# EAGLE design pcbWithoutuE (EAGLE 9.1.3)
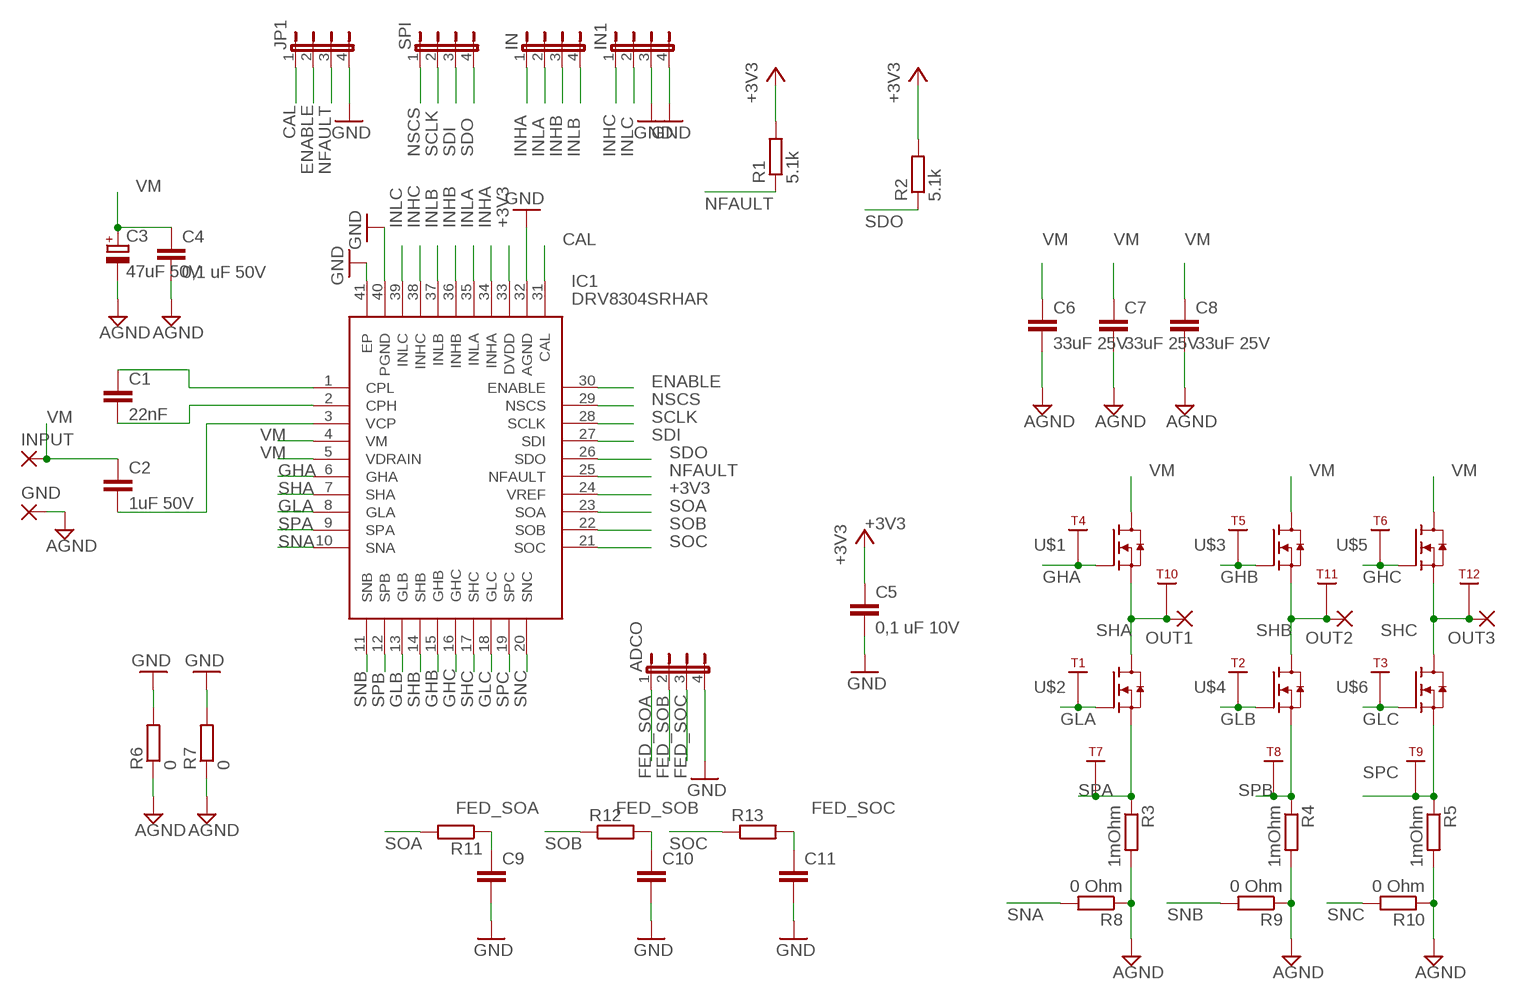
[diagram p0: schematic, sheet 1]

## Parts
ADCO  JP4E  [JP4]
C1  22nF  C-EUC0805K  [C0805K]
C2  1uF 50V  C-EUC0805K  [C0805K]
C3  47uF 50V  CPOL-EUE7.5-16  [E7,5-16]
C4  0,1 uF 50V  C-EUC0805K  [C0805K]
C5  0,1 uF 10V  C-EUC0805K  [C0805K]
C6  33uF 25V  C-EUC1206K  [C1206K]
C7  33uF 25V  C-EUC1206K  [C1206K]
C8  33uF 25V  C-EUC1206K  [C1206K]
C9  C-EUC0805  [C0805]
C10  C-EUC0805  [C0805]
C11  C-EUC0805  [C0805]
GND  3,17/1,3  [3,17/1,3]
IC1  DRV8304SRHAR  [QFN50P600X600X100-41N]
IN  JP4E  [JP4]
IN1  JP4E  [JP4]
INPUT  3,17/1,3  [3,17/1,3]
JP1  JP4E  [JP4]
OUT1  SMD2  [SMD1,27-2,54]
OUT2  SMD2  [SMD1,27-2,54]
OUT3  SMD2  [SMD1,27-2,54]
R1  5.1k  R-EU_R0805  [R0805]
R2  5.1k  R-EU_R0805  [R0805]
R3  1mOhm  R-EU_R1216_SHUNT  [1216]
R4  1mOhm  R-EU_R1216_SHUNT  [1216]
R5  1mOhm  R-EU_R1216_SHUNT  [1216]
R6  0  R-EU_R0805W  [R0805W]
R7  0  R-EU_R0805W  [R0805W]
R8  0 Ohm  R-EU_R0603  [R0603]
R9  0 Ohm  R-EU_R0603  [R0603]
R10  0 Ohm  R-EU_R0603  [R0603]
R11  R-EU_R0805  [R0805]
R12  R-EU_R0805  [R0805]
R13  R-EU_R0805  [R0805]
SPI  JP4E  [JP4]
T1  TEST_POINT1593  [TURRET_TERMINAL_1593]
T2  TEST_POINT1593  [TURRET_TERMINAL_1593]
T3  TEST_POINT1593  [TURRET_TERMINAL_1593]
T4  TEST_POINT1593  [TURRET_TERMINAL_1593]
T5  TEST_POINT1593  [TURRET_TERMINAL_1593]
T6  TEST_POINT1593  [TURRET_TERMINAL_1593]
T7  TEST_POINT1593  [TURRET_TERMINAL_1593]
T8  TEST_POINT1593  [TURRET_TERMINAL_1593]
T9  TEST_POINT1593  [TURRET_TERMINAL_1593]
T10  TEST_POINT1593  [TURRET_TERMINAL_1593]
T11  TEST_POINT1593  [TURRET_TERMINAL_1593]
T12  TEST_POINT1593  [TURRET_TERMINAL_1593]
U$1  SIRA80DP-T1-RE3-CLASSIC  [SI7852ADPT1GE3]
U$2  SIRA80DP-T1-RE3-CLASSIC  [SI7852ADPT1GE3]
U$3  SIRA80DP-T1-RE3-CLASSIC  [SI7852ADPT1GE3]
U$4  SIRA80DP-T1-RE3-CLASSIC  [SI7852ADPT1GE3]
U$5  SIRA80DP-T1-RE3-CLASSIC  [SI7852ADPT1GE3]
U$6  SIRA80DP-T1-RE3-CLASSIC  [SI7852ADPT1GE3]

## Nets
+3V3: C5.1 IC1.24(VREF) IC1.33(DVDD) R1.2 R2.2
AGND: C3.- C4.2 C6.2 C7.2 C8.2 GND.1(P) R3.P$2 R3.P$4 R4.P$2 R4.P$4 R5.P$2 R5.P$4 R6.1 R7.1 R8.1 R9.1 R10.1
CAL: IC1.31(CAL) JP1.1
ENABLE: IC1.30(ENABLE) JP1.2
FED_SOA: ADCO.1 C9.1 R11.1
FED_SOB: ADCO.2 C10.1 R12.2
FED_SOC: ADCO.3 C11.1 R13.2
GHA: IC1.6(GHA) T4.1 U$1.4(G)
GHB: IC1.15(GHB) T5.1 U$3.4(G)
GHC: IC1.16(GHC) T6.1 U$5.4(G)
GLA: IC1.8(GLA) T1.1 U$2.4(G)
GLB: IC1.13(GLB) T2.1 U$4.4(G)
GLC: IC1.18(GLC) T3.1 U$6.4(G)
GND: ADCO.4 C5.2 C9.2 C10.2 C11.2 IC1.32(AGND) IC1.40(PGND) IC1.41(EP) IN1.3 IN1.4 JP1.4 R6.2 R7.2
INHA: IC1.34(INHA) IN.1
INHB: IC1.36(INHB) IN.3
INHC: IC1.38(INHC) IN1.1
INLA: IC1.35(INLA) IN.2
INLB: IC1.37(INLB) IN.4
INLC: IC1.39(INLC) IN1.2
N$1: C1.1 IC1.1(CPL)
N$2: C1.2 IC1.2(CPH)
N$3: C2.2 IC1.3(VCP)
NFAULT: IC1.25(NFAULT) JP1.3 R1.1
NSCS: IC1.29(NSCS) SPI.1
SCLK: IC1.28(SCLK) SPI.2
SDI: IC1.27(SDI) SPI.3
SDO: IC1.26(SDO) R2.1 SPI.4
SHA: IC1.7(SHA) OUT1.1(P) T10.1 U$1.1(S) U$1.2(S) U$1.3(S) U$2.5(D) U$2.6(D) U$2.7(D) U$2.8(D) U$2.9(D) U$2.10(D) U$2.11(D)
SHB: IC1.14(SHB) OUT2.1(P) T11.1 U$3.1(S) U$3.2(S) U$3.3(S) U$4.5(D) U$4.6(D) U$4.7(D) U$4.8(D) U$4.9(D) U$4.10(D) U$4.11(D)
SHC: IC1.17(SHC) OUT3.1(P) T12.1 U$5.1(S) U$5.2(S) U$5.3(S) U$6.5(D) U$6.6(D) U$6.7(D) U$6.8(D) U$6.9(D) U$6.10(D) U$6.11(D)
SNA: IC1.10(SNA) R8.2
SNB: IC1.11(SNB) R9.2
SNC: IC1.20(SNC) R10.2
SOA: IC1.23(SOA) R11.2
SOB: IC1.22(SOB) R12.1
SOC: IC1.21(SOC) R13.1
SPA: IC1.9(SPA) R3.P$1 R3.P$3 T7.1 U$2.1(S) U$2.2(S) U$2.3(S)
SPB: IC1.12(SPB) R4.P$1 R4.P$3 T8.1 U$4.1(S) U$4.2(S) U$4.3(S)
SPC: IC1.19(SPC) R5.P$1 R5.P$3 T9.1 U$6.1(S) U$6.2(S) U$6.3(S)
VM: C2.1 C3.+ C4.1 C6.1 C7.1 C8.1 IC1.4(VM) IC1.5(VDRAIN) INPUT.1(P) U$1.5(D) U$1.6(D) U$1.7(D) U$1.8(D) U$1.9(D) U$1.10(D) U$1.11(D) U$3.5(D) U$3.6(D) U$3.7(D) U$3.8(D) U$3.9(D) U$3.10(D) U$3.11(D) U$5.5(D) U$5.6(D) U$5.7(D) U$5.8(D) U$5.9(D) U$5.10(D) U$5.11(D)

## Library data of the parts
ADCO IN IN1 JP1 SPI = jumper:JP4E: JUMPER
C1 C2 C4-C8 = rcl:C-EU: CAPACITOR, European symbol; SPICEPREFIX: C
C3 = rcl:CPOL-EU: POLARIZED CAPACITOR, European symbol; SPICEPREFIX: C
C9-C11 = resistor:C-EU: CAPACITOR, European symbol
GND INPUT = wirepad:3,17/1,3: THROUGH-HOLE PAD
IC1 = SamacSys_Parts2:DRV8304SRHAR: Triple Half Bridge Motor Driver 40-Pin VQFN EP T/R Source: Datasheet <https://www.ti.com/lit/gpn/DRV8304>; DESCRIPTION: Triple Half Bridge Motor Driver 40-Pin VQFN EP T/R; HEIGHT: 1mm; MANUFACTURER_NAME: Texas Instruments; MANUFACTURER_PART_NUMBER: DRV8304SRHAR; MOUSER_PART_NUMBER: 595-DRV8304SRHAR; MOUSER_PRICE-STOCK: https://www.mouser.com/Search/Refine.aspx?Keyword=595-DRV8304SRHAR
OUT1-OUT3 = wirepad:SMD2: SMD PAD
R1 R2 R6 R7 = rcl:R-EU_: RESISTOR, European symbol; SPICEPREFIX: R
R3-R5 = resistor_mod:R-EU_: SHUNT RESISTOR, European symbol 3W
R8-R13 = resistor:R-EU_: RESISTOR, European symbol
T1-T12 = ERIC:TEST_POINT: Test Points
U$1-U$6 = SamacSys_Parts2:SIRA80DP-T1-RE3-CLASSIC

## Board
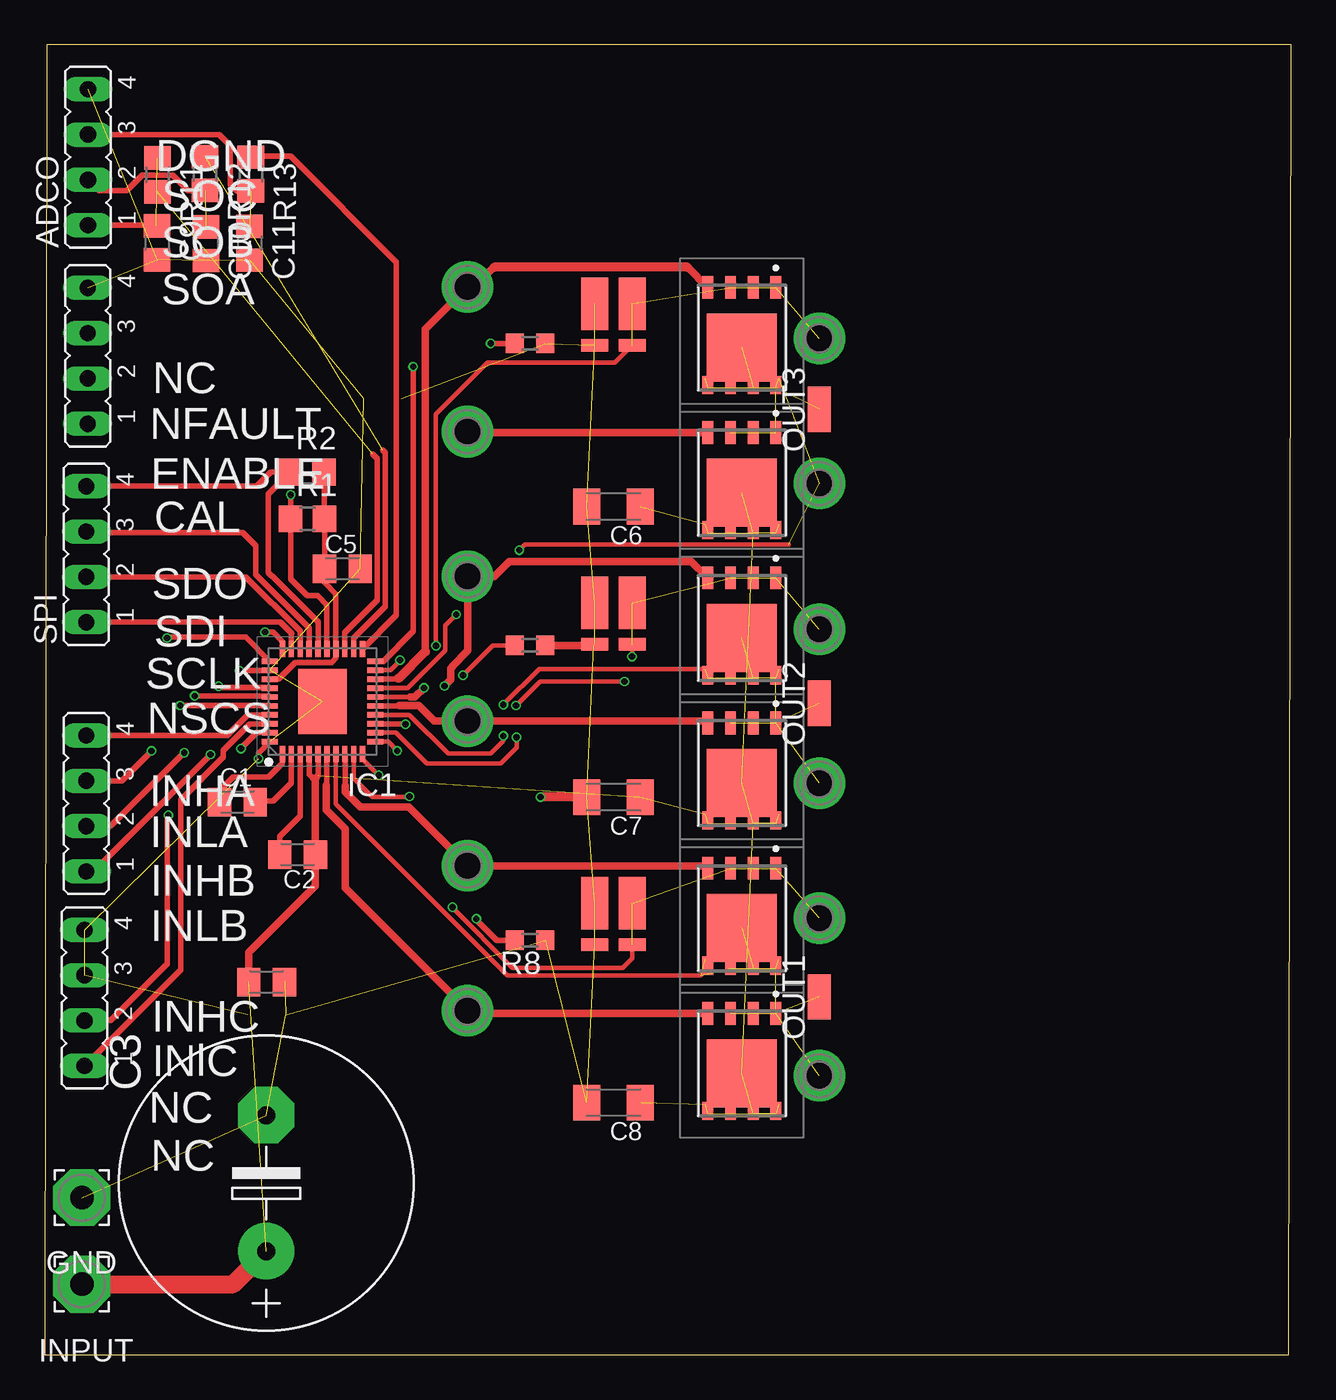
[diagram p1: board, top side]
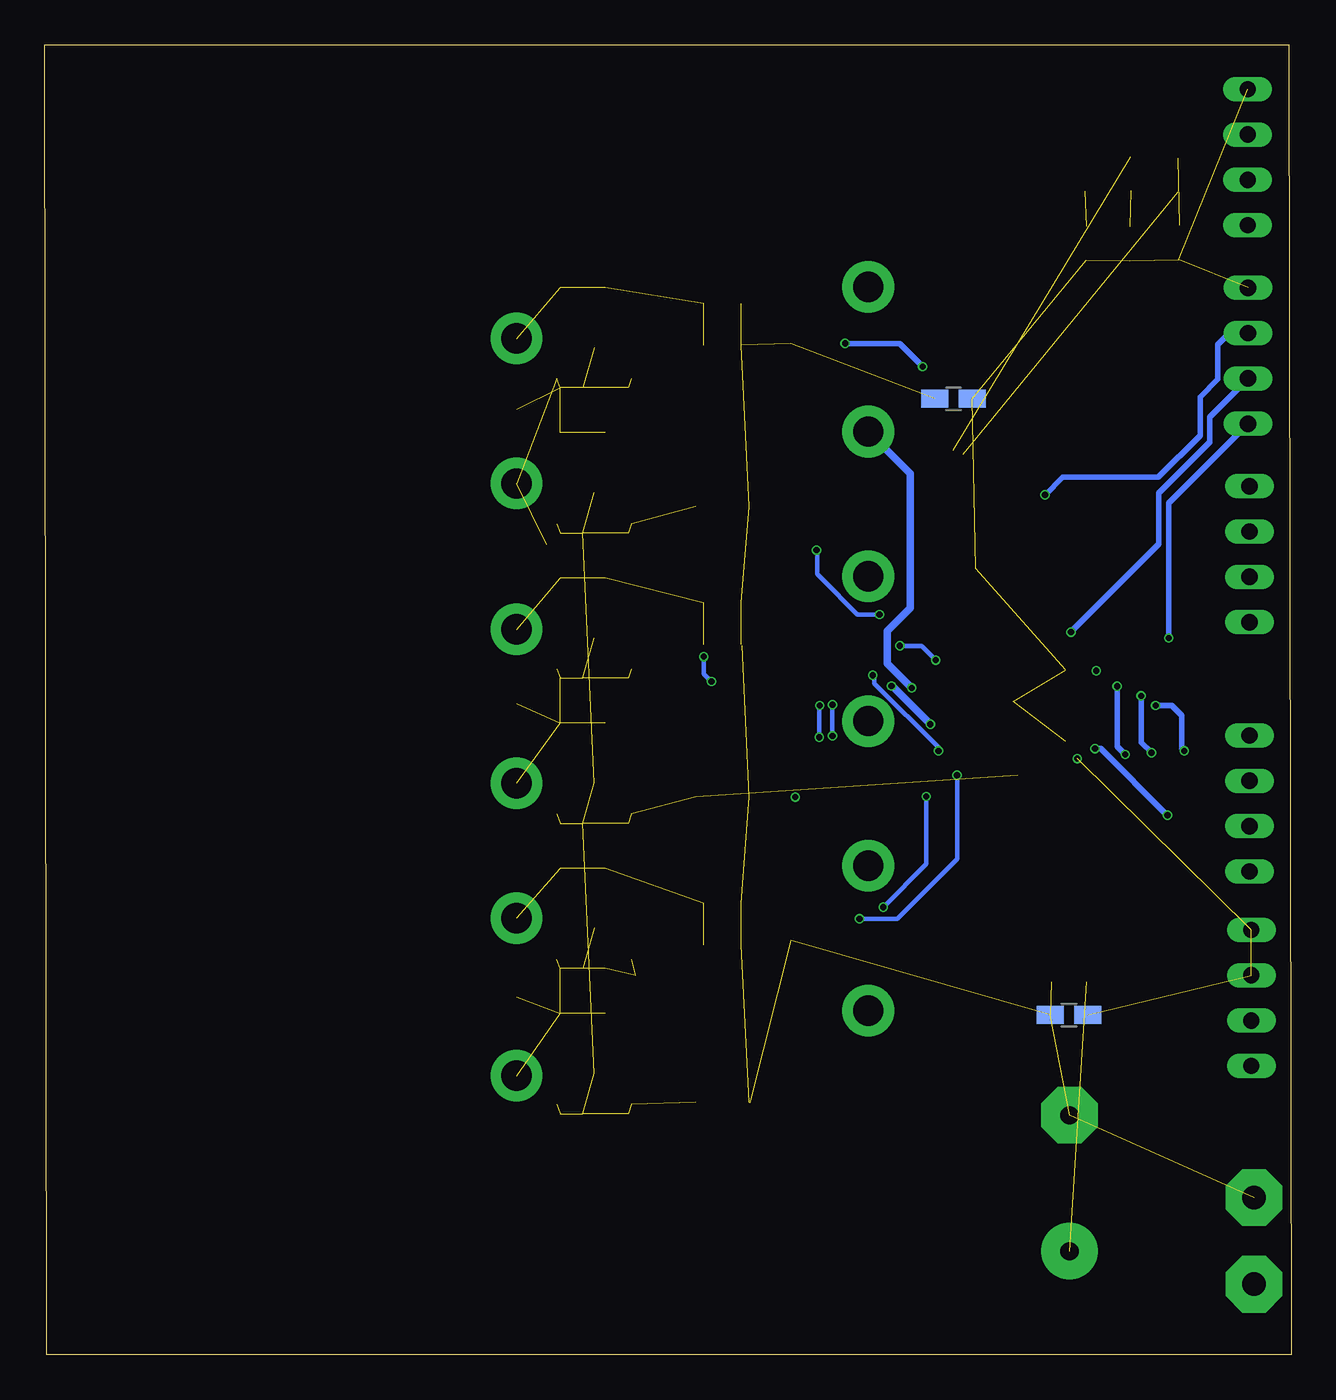
[diagram p2: board, bottom side, seen from below]

Size 69.85 x 73.45 mm. Coordinates in mm from the lower left corner, seen from the top.
Outline: 0,0 69.72,0 69.85,73.45 0.13,73.45 0,0
Copper layers (1*16): Top 0.035559375mm / dielectric 1.6mm / Bottom 0.035559375mm
Design rules "jlcpcb2layer": minimum track width 5mil, minimum drill 12mil, track to track 5mil, track to pad 5mil, pad to pad 5mil, via to via 5mil, smd to smd 5mil, copper to edge 8mil, drill to drill 6mil, minimum pad ring 5mil, minimum via ring 3mil, stop-mask expansion 2.5mil, vias tented up to drill 0mil, thermal gap 10mil

### Footprints (pad centres in the part's own frame; a part is rotated, then mirrored left to right if it is on the bottom)
JP4 = drill 0.914 long: 1 -3.81,0; 2 -1.27,0; 3 1.27,0; 4 3.81,0
C0805K = smd 1.3 x 1.6: 1 -1,0; 2 1,0
E7,5-16 = drill 1.016 pad 3.15: + -3.81,0 | drill 1.016 pad 3.15 octagon: - 3.81,0
C1206K = smd 1.5 x 2: 1 -1.5,0; 2 1.5,0
C0805 = smd 1.3 x 1.5: 1 -0.95,0; 2 0.95,0
3,17/1,3 = drill 1.321 pad 3.175 octagon: 1 0,0
QFN50P600X600X100-41N = smd 0.9 x 0.3: 1 -2.95,2.25; 2 -2.95,1.75; 3 -2.95,1.25; 4 -2.95,0.75; 5 -2.95,0.25; 6 -2.95,-0.25; 7 -2.95,-0.75; 8 -2.95,-1.25; 9 -2.95,-1.75; 10 -2.95,-2.25; 21 2.95,-2.25; 22 2.95,-1.75; 23 2.95,-1.25; 24 2.95,-0.75; 25 2.95,-0.25; 26 2.95,0.25; 27 2.95,0.75; 28 2.95,1.25; 29 2.95,1.75; 30 2.95,2.25 | smd 0.3 x 0.9: 11 -2.25,-2.95; 12 -1.75,-2.95; 13 -1.25,-2.95; 14 -0.75,-2.95; 15 -0.25,-2.95; 16 0.25,-2.95; 17 0.75,-2.95; 18 1.25,-2.95; 19 1.75,-2.95; 20 2.25,-2.95; 31 2.25,2.95; 32 1.75,2.95; 33 1.25,2.95; 34 0.75,2.95; 35 0.25,2.95; 36 -0.25,2.95; 37 -0.75,2.95; 38 -1.25,2.95; 39 -1.75,2.95; 40 -2.25,2.95 | smd 3.62 x 2.72: 41 0,0
SMD1,27-2,54 = smd 1.27 x 2.54: 1 0,0
R0805 = smd 1.3 x 1.5: 1 -0.95,0; 2 0.95,0
1216 = smd 1.5 x 2.95: P$1 -1.05,-2.075; P$2 1.05,-2.075 | smd 1.5 x 0.7: P$3 -1.05,0.25; P$4 1.05,0.25
R0805W = smd 1.5 x 1: 1 -1.052,0; 2 1.052,0
R0603 = smd 1 x 1.1: 1 -0.85,0; 2 0.85,0
TURRET_TERMINAL_1593 = drill 1.702 pad 2.89: 1 0,0
SI7852ADPT1GE3 = smd 1.27 x 0.61: 1 -2.81,1.905; 2 -2.81,0.635; 3 -2.81,-0.635; 4 -2.81,-1.905 | smd 0.71 x 0.61: 5 2.81,-1.905; 6 2.81,-0.635; 7 2.81,0.635; 8 2.81,1.905 | smd 3.81 x 3.91: 9 0.55,0 | smd 0.31 x 0.255: 10 2.3,2.083; 11 2.3,-2.083

### Placement (x,y rotation side)
ADCO  2.44,67.13 90 top
C1  10.8,30.99 0 top
C2  14.17,28.04 180 top
C3  12.42,9.63 90 top
C4  12.45,20.9 0 top
C5  16.69,44.07 0 top
C6  31.88,47.55 180 top
C7  31.88,31.27 180 top
C8  31.88,14.15 180 top
C9  6.3,62.33 270 top
C10  9.04,62.28 270 top
C11  11.48,62.31 270 top
GND  2.08,8.81 90 top
IC1  15.57,36.63 90 top
IN  2.34,30.91 90 top
IN1  2.24,20.02 90 top
INPUT  2.08,3.96 90 top
JP1  2.41,56.01 90 top
OUT1  43.41,20.07 0 top
OUT2  43.41,36.53 0 top
OUT3  43.41,53.01 0 top
R1  14.73,46.86 0 top
R2  14.71,49.48 0 top
R3  31.88,23.24 180 top
R4  31.88,40.08 180 top
R5  31.88,56.85 180 top
R6  18.92,53.59 0 bottom
R7  12.45,19.05 0 bottom
R8  27.2,23.24 180 top
R9  27.2,39.78 180 top
R10  27.2,56.69 180 top
R11  6.32,66.14 270 top
R12  8.99,66.22 270 top
R13  11.56,66.19 270 top
SPI  2.34,44.88 90 top
T1  23.7,27.42 0 top
T2  23.7,43.64 0 top
T3  23.7,59.87 0 top
T4  23.7,19.3 0 top
T5  23.7,35.53 0 top
T6  23.7,51.76 0 top
T7  43.41,24.49 0 top
T8  43.41,40.67 0 top
T9  43.41,56.97 0 top
T10  43.41,15.65 0 top
T11  43.41,32.05 0 top
T12  43.41,48.84 0 top
U$1  39.07,16.33 270 top
U$2  39.07,24.47 270 top
U$3  39.07,32.61 270 top
U$4  39.07,40.75 270 top
U$5  39.07,48.88 270 top
U$6  39.07,57.02 270 top

### Tracks (layer width: path | path; a pad name or v marks a point on that pad's centre or on a via)
+3V3
  Top 0.305: IC1.33 13.12,37.88 13.35,38.11 14.05,38.81 16.08,38.81 16.32,39.05 IC1.24 16.32,42.66 15.69,43.29 C5.1 R1.2 15.68,49.45 R2.2
AGND  (via drill 0.35)  (15 unrouted)
  Top 0.406: R9.1 30.77,39.78 R4.P$4 | 30.35,14.12 C8.2
  Top 0.508: C7.2 v27.79,31.27
CAL  (via drill 0.35)
  Top 0.305: IC1.31 11.26,40.23 6.86,40.23 v6.86,40.18
  Bottom 0.305: v6.86,40.18 6.86,47.75 JP1.1
ENABLE  (via drill 0.35)
  Top 0.305: IC1.30 13.32,39.99 12.8,40.51 v12.34,40.51
  Bottom 0.305: v12.34,40.51 7.42,45.44 7.42,48.31 4.57,51.16 4.57,52.58 JP1.2
FED_SOA  (1 unrouted)
  Top 0.305: ADCO.1 6.26,63.32 C9.1
FED_SOB  (1 unrouted)
  Top 0.305: ADCO.2 3.03,65.27 4.61,65.27 5.46,66.12 7.19,66.12 8.04,65.27 R12.2
FED_SOC  (1 unrouted)
  Top 0.305: ADCO.3 9.78,68.4 10.41,67.77 10.41,65.63 10.81,65.24 R13.2
GHA
  Top 0.305: 15.77,31.93 15.82,31.97 IC1.6
  Top 0.406: U$1.4 23.86,19.14 T4.1 16.84,26.16 16.84,29.49 15.77,30.56 15.77,31.93
GHB
  Top 0.305: IC1.15 19.84,36.38 19.86,36.4
  Top 0.406: 19.86,36.4 20.96,36.4 21.82,35.53 T5.1 37.05,35.53 U$3.4
GHC  (via drill 0.35)
  Top 0.254: IC1.16 20.49,36.88 20.5,36.88
  Top 0.406: U$5.4 23.76,51.69 T6.1 | 20.49,36.88 20.75,36.88 v21.26,37.39
  Bottom 0.406: v21.26,37.39 22.63,38.76 22.63,40.56 21.34,41.86 21.34,49.39 T6.1
GLA
  Top 0.305: 16.84,31.9 16.84,33.66 IC1.8
  Top 0.406: U$2.4 37.02,27.42 T1.1 20.41,30.71 17.68,30.71 16.84,31.55 16.84,31.9
GLB  (via drill 0.35)
  Top 0.305: IC1.13 20.2,35.38 v20.22,35.36
  Top 0.406: U$4.4 36.25,44.48 26.04,44.48 25.2,43.64 T2.1 23.72,43.62 23.72,39.47 22.85,38.59 22.85,38.57 22.76,38.48 22.76,37.85 v22.4,37.49
  Bottom 0.406: v20.22,35.36 22.38,37.52 v22.4,37.49
GLC
  Top 0.305: IC1.18 19.79,37.88 19.84,37.93
  Top 0.406: U$6.4 36.03,60.96 | 25.17,60.96 24.08,59.87 T3.1 21.34,57.51 21.34,39.42 | 19.84,37.93
  Top 0.508: 36.03,60.96 25.17,60.96 | 21.34,39.42 19.84,37.93
GND  (via drill 0.35)  (12 unrouted)
  Top 0.305: IC1.32 12.6,38.35 v10.92,38.35 | IC1.40 11.99,33.75 v11.99,33.43
INHA  (via drill 0.35)
  Top 0.305: IN.1 2.74,27.1 v9.3,33.65 | IC1.34 12.6,37.4 12,37.4 11.99,37.41 9.83,37.41 v9.75,37.48
  Bottom 0.305: v9.3,33.65 9.75,34.11 v9.75,37.48
INHB  (via drill 0.35)
  Top 0.305: IN.3 4.32,32.18 v5.99,33.86 | v7.59,36.4 12.6,36.4 IC1.36
  Bottom 0.305: v5.99,33.86 6.12,33.98 6.12,35.84 6.68,36.4 v7.59,36.4
INHC
  Top 0.305: IC1.38 11.5,35.38 10.01,33.88 10.01,33.5 7.62,31.11 7.62,21.59 IN1.1
INLA  (via drill 0.35)
  Top 0.305: IN.2 3.71,29.64 v7.82,33.76 | v8.41,36.94 12.56,36.94 IC1.35
  Bottom 0.305: v7.82,33.76 8.41,34.34 v8.41,36.94
INLB
  Top 0.305: IN.4 10.24,34.72 11.39,35.88 IC1.37
INLC  (via drill 0.35)
  Top 0.305: IN1.2 3.71,18.74 6.88,21.92 6.88,30.2 v6.93,30.25 | v11,33.98 11.89,34.88 IC1.39
  Bottom 0.305: v6.93,30.25 10.67,33.98 v11,33.98
N$1
  Top 0.305: IC1.1 13.32,33.16 12.55,32.38 10.57,32.38 9.8,31.61 C1.1
N$2
  Top 0.305: C1.2 11.85,31.04 12.8,31.04 13.82,32.06 IC1.2
N$3
  Top 0.305: C2.2 13.17,29.07 14.32,30.22 IC1.3
NFAULT  (via drill 0.35)
  Top 0.305: IC1.25 15.82,42.04 15.29,42.57 14.71,42.57 13.78,43.49 R1.1 v13.78,48.2 v13.79,48.21
  Bottom 0.305: v13.79,48.21 12.8,49.2 7.44,49.2 5.11,51.54 5.11,53.7 4.12,54.69 4.12,56.64 3.48,57.28 JP1.3
NSCS
  Top 0.305: IC1.29 13.82,40.41 13.84,40.44 13.21,41.07 SPI.1
SCLK
  Top 0.305: IC1.28 14.32,40.57 11.28,43.61 SPI.2
SDI
  Top 0.305: IC1.27 14.82,40.75 11.84,43.74 11.84,45.36 11.1,46.1 2.39,46.1 SPI.3
SDO
  Top 0.305: IC1.26 15.32,41.09 12.75,43.66 12.73,43.66 12.52,43.87 12.52,48.24 R2.1 12.67,49.48 11.89,48.69 SPI.4
SHA  (11 unrouted)
  Top 0.254: IC1.7 16.32,30.87 25.93,21.26 36.76,21.26 U$2.5
SHB  (via drill 0.35)  (11 unrouted)
  Top 0.254: IC1.14 20.44,35.88 22.61,33.71 24.99,33.71 25.71,34.42 v25.71,34.7 | v25.71,36.45 27.7,38.45 U$4.11
  Bottom 0.254: v25.71,34.7 v25.71,36.45 | v25.71,36.45 25.71,36.47 v25.71,36.45
SHC  (via drill 0.35)  (12 unrouted)
  Top 0.254: IC1.17 20.34,37.38 22.45,39.49 22.45,40.89 22.71,41.15 v23.06,41.5 | v26.59,45.11 26.9,45.41 41.71,45.41
  Bottom 0.254: v23.06,41.5 24.31,41.5 26.31,43.51 26.57,43.76 26.57,44.93 26.57,45.08 v26.59,45.11
SNA  (via drill 0.35)
  Top 0.254: v18.72,32.49 17.82,33.39 IC1.10
  Top 0.305: R8.2 25.32,23.24 24.16,24.41 v24.19,24.44
  Bottom 0.254: v24.19,24.44 23.17,24.44 22.06,24.44 18.72,27.79 v18.72,32.49
SNB  (via drill 0.35)
  Top 0.254: IC1.11 19.24,34.38 v19.76,33.86 | v23.44,38.1 25.12,39.78 R9.2
  Bottom 0.254: v23.44,38.1 23.37,38.02 23.37,37.92 23.37,37.64 19.76,34.04 v19.76,33.86
SNC  (via drill 0.35)
  Top 0.305: IC1.20 18.96,38.88 20.65,40.56 v20.65,55.4 | v20.65,55.4 20.65,55.42 v20.65,55.4 | v24.99,56.69 R10.2
  Bottom 0.305: v20.65,55.4 21.95,56.69 v24.99,56.69
SOA  (1 unrouted)
  Top 0.305: IC1.23 16.82,40.49 18.64,42.32 18.64,50.24 18.39,50.49
SOB  (1 unrouted)
  Top 0.305: IC1.22 17.32,40.18 19.1,41.96 19.1,50.57 18.95,50.72
SOC
  Top 0.305: IC1.21 19.71,41.47 19.71,61.26 13.79,67.18 11.6,67.18 R13.1
SPA  (via drill 0.35)  (5 unrouted)
  Top 0.254: IC1.9 17.32,32.31 18.36,31.27 20.32,31.27 20.35,31.3 v20.45,31.3 | R3.P$3 32.93,22.23 32.39,21.69 26.21,21.69 22.86,25.04 v22.86,25.09
  Bottom 0.254: v20.45,31.3 20.45,27.51 v22.86,25.09
SPB  (via drill 0.35)  (5 unrouted)
  Top 0.254: IC1.12 19.68,34.88 21.41,33.15 25.55,33.15 26.44,34.04 v26.44,34.62 | v26.42,36.4 27.76,37.74 v32.49,37.74 | v32.92,39.14 32.92,39.82 R4.P$3
  Bottom 0.254: v26.44,34.62 26.44,36.37 v26.42,36.4 | v32.49,37.74 32.92,38.18 v32.92,39.14
SPC  (via drill 0.35)  (5 unrouted)
  Top 0.254: R5.P$3 31.96,55.63 24.82,55.63 21.92,52.73 v21.92,39.75 v21.93,39.75 | IC1.19 19.39,38.38 19.94,38.92 v19.91,38.95
  Bottom 0.254: v19.91,38.95 20.7,39.73 21.91,39.73 v21.93,39.75
VM  (25 unrouted)
  Top 0.305: 15.21,32.36 15.32,32.46 IC1.5 | IC1.4 14.82,32.53 15.17,32.18
  Top 0.406: 15.21,32.36 15.17,32.32 15.17,32.18 C2.1 15.17,26.3 11.45,22.57 C4.1
  Top 1.016: INPUT.1 10.57,3.96 C3.+

### Text on the board
tNames: DGND | SOC | SOB | SOA | NC | NFAULT | ENABLE | CAL | SDO | SDI | SCLK | NSCS | INHA | INLA | INHB | INLB | INHC | INlC | NC | NC